# EAGLE schematic servo-actuator (EAGLE 7.2.0)
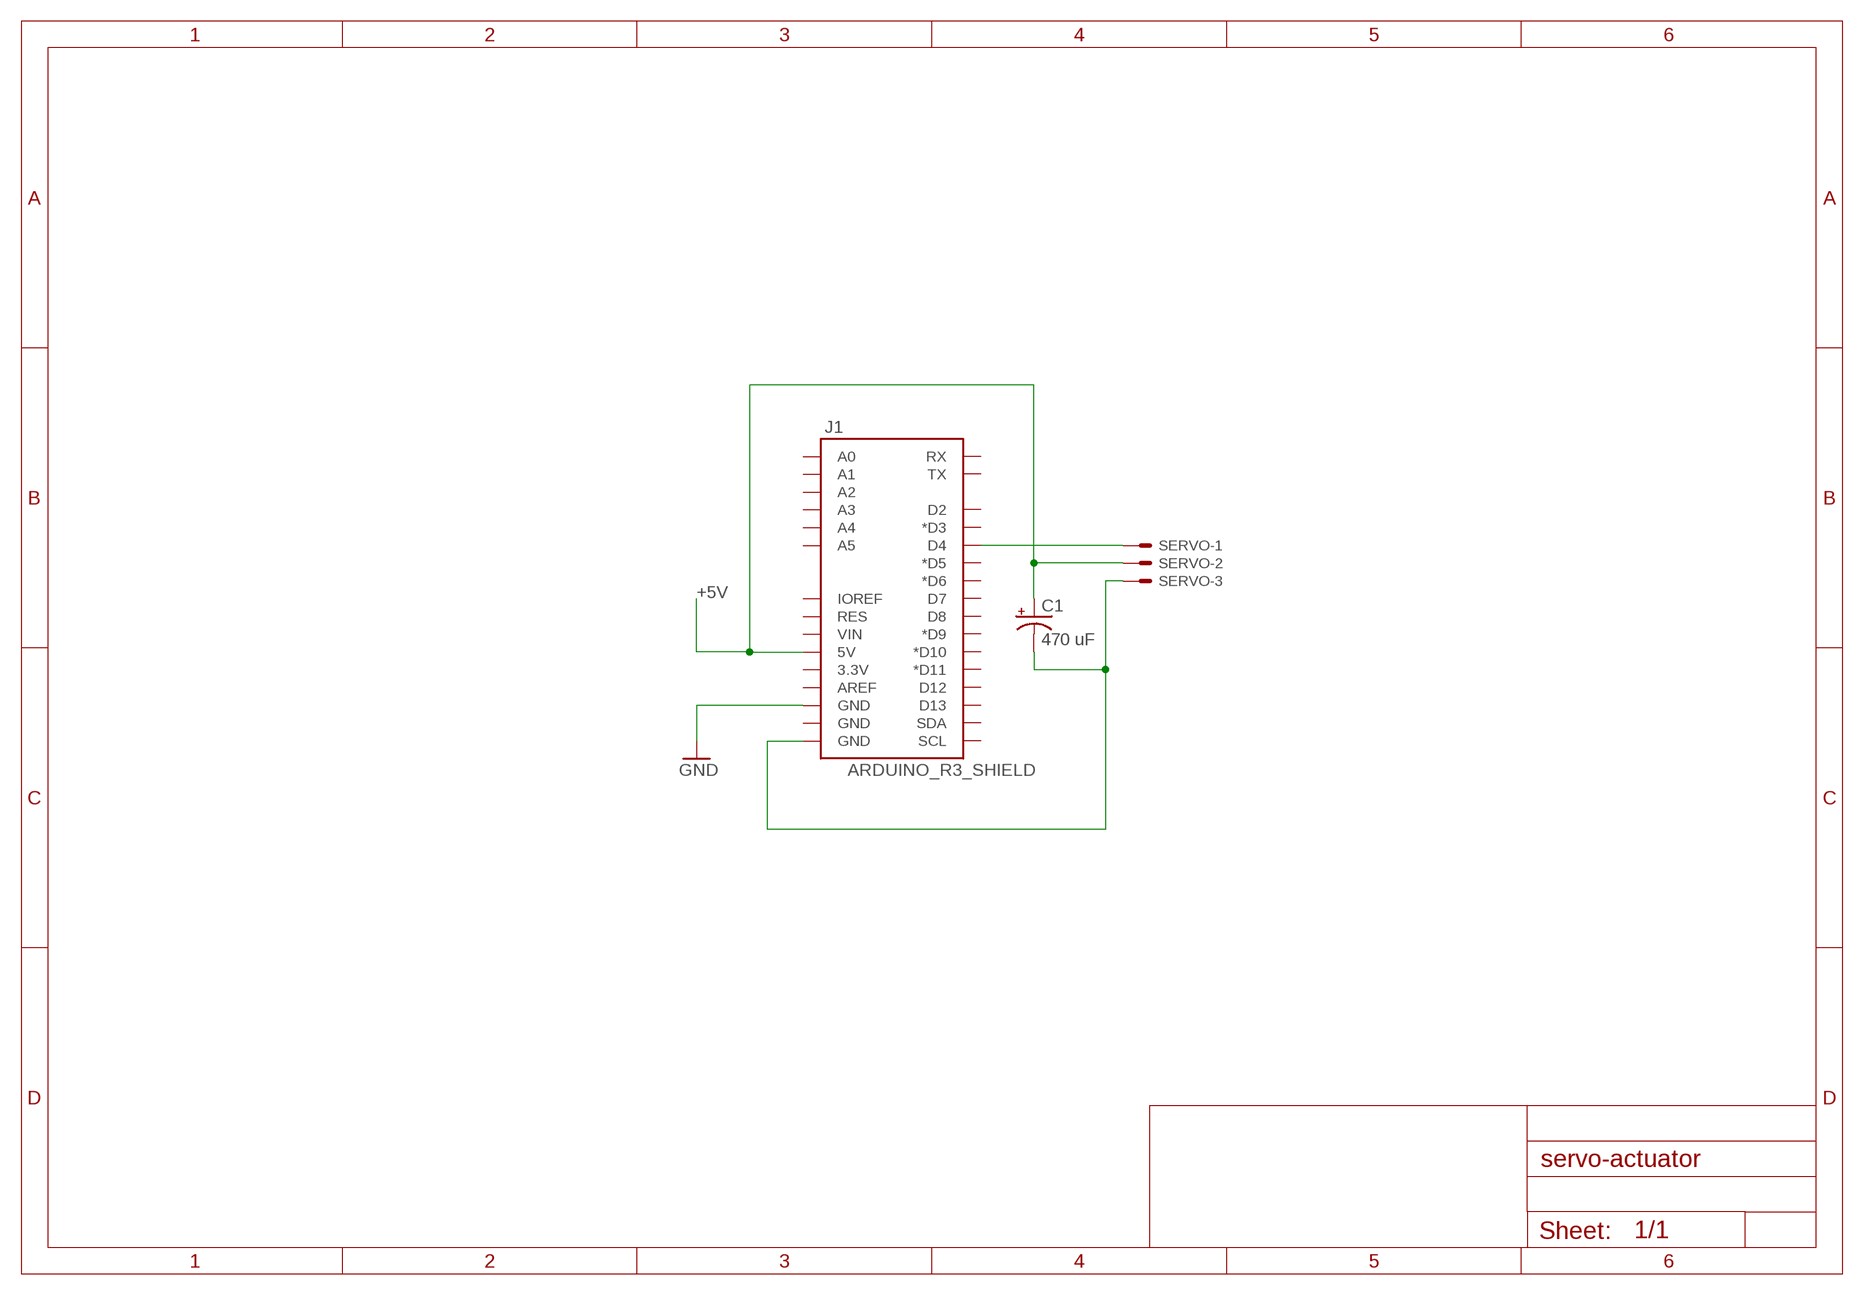
[diagram p0: schematic, sheet 1]

## Parts
C1  470 uF  CAP_POL1206  [EIA3216]
J1  ARDUINO_R3_SHIELD  [UNO_R3_SHIELD]
SERVO  22-23-2031  [22-23-2031]

## Nets
+5V: C1.A(+) J1.5V SERVO.2
GND: J1.GND@2(GND)
N$2: J1.D4 SERVO.1
N$3: C1.C(-) J1.GND@0(GND) SERVO.3
Unconnected: J1.3.3V J1.A0 J1.A1 J1.A2 J1.A3 J1.A4 J1.A5 J1.AREF J1.D2 J1.D3(*D3) J1.D5(*D5) J1.D6(*D6) J1.D7 J1.D8 J1.D9(*D9) J1.D10(*D10) J1.D11(*D11) J1.D12 J1.D13 J1.GND@1(GND) J1.IOREF J1.RES J1.RX J1.SCL J1.SDA J1.TX J1.VIN

## Library data of the parts
C1 = ME210Lib_2015_v2:CAP_POL: Capacitor Polarized These are standard SMD and PTH capacitors. Normally 10uF, 47uF, and 100uF in electrolytic and tantalum varieties. Always verify the external diameter of the through hole cap, it varies with capacity, voltage, and manufacturer. The EIA devices should be standard.
J1 = ME210Lib_2015_v2:ARDUINO_R3_SHIELD: Shield form compatible with the Arduino Uno R3.
SERVO = con-molex:22-23-2031: .100" (2.54mm) Center Header - 3 Pin; MF: MOLEX; MPN: 22-23-2031; OC_FARNELL: 1462950; OC_NEWARK: 30C0862